# Altium project recive_coil.PrjPcb
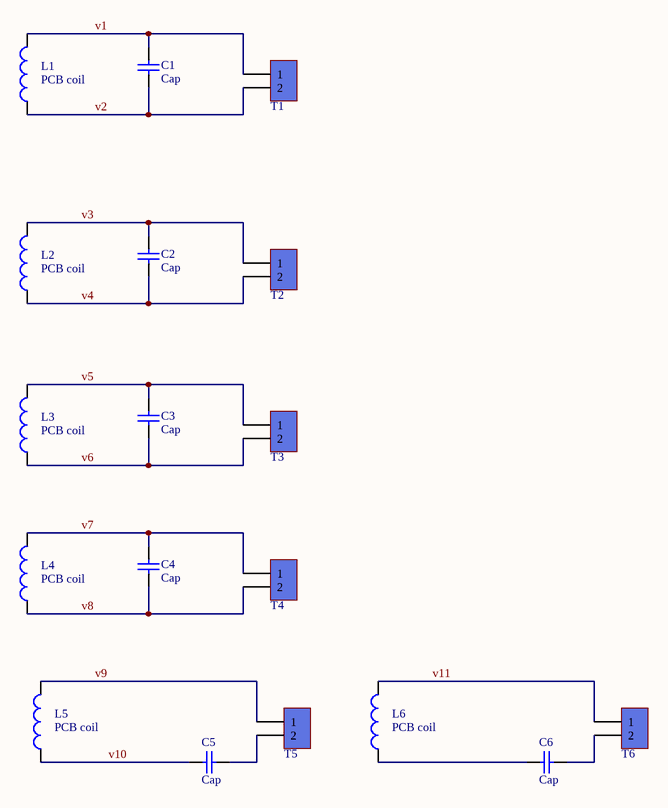
[diagram p0: Sheet1.SchDoc]
1 sheet, 18 parts. Net scope: global (net labels, ports and power ports of the same name join across sheets).
Board files: PCB1.PcbDoc, PCB2.PcbDoc

## Sheet Sheet1.SchDoc
size A4

### Parts
C1  Cap  [CAP_MKT]
C2  Cap  [CAP_MKT]
C3  Cap  [CAP_MKT]
C4  Cap  [CAP_MKT]
C5  Cap  [CAP_MKT]
C6  Cap  [CAP_MKT]
L1  PCB coil  [coil_30*30_1mm_2layer]  (net tie)
L2  PCB coil  [coil_30*30_2mm_1layer]  (net tie)
L3  PCB coil  [coil_30*30_2mm_2layer]  (net tie)
L4  PCB coil  [coil_30*30_3mm_2layer]  (net tie)
L5  PCB coil  [COIL_HEX_50*50_2layer]  (net tie)
L6  PCB coil  [COIL_HEX_50*50_2LAYER_2mm]  (net tie)
T1  Terminal  [Terminal 1*2_coil]  (value not drawn)
T2  Terminal  [Terminal 1*2_coil]  (value not drawn)
T3  Terminal  [Terminal 1*2_coil]  (value not drawn)
T4  Terminal  [Terminal 1*2_coil]  (value not drawn)
T5  Terminal  [Terminal 1*2_coil]  (value not drawn)
T6  Terminal  [Terminal 1*2_coil]  (value not drawn)

### Nets
v1: C1.2 L1.2 T1.1
v2: C1.1 L1.1 T1.2
v3: C2.2 L2.2 T2.1
v4: C2.1 L2.1 T2.2
v5: C3.2 L3.2 T3.1
v6: C3.1 L3.1 T3.2
v7: C4.2 L4.2 T4.1
v8: C4.1 L4.1 T4.2
v9: L5.2 T5.1
v10: C5.2 L5.1
v11: L6.2 T6.1
NetC5_1: C5.1 T5.2
NetC6_1: C6.1 T6.2
NetC6_2: C6.2 L6.1

### Library data of the parts
C1-C6 = Cap: Capacitor; Value: 100pF; Published: 8-Jun-2000; LatestRevisionDate: 17-Jul-2002; LatestRevisionNote: Re-released for DXP Platform.; PackageReference: RAD-0.3; Publisher: Altium Limited; PackageDescription: Radial Cap, Thru-Hole; 2 Leads; 0.3 in Pin Spacing
L1-L6 = Inductor: Code_IEC: 1005; Value: 10mH; Published: 8-Jun-2000; LatestRevisionDate: 29-May-2009; LatestRevisionNote: IPC-7351 Footprint Added.; PackageReference: 0402-A; Publisher: Altium Limited; PackageDescription: Chip Inductor; Code_JEITA: 0402
T1-T6 = Terminal 1*2: Terminal 2 Pin 250VAC 16A; Designer: Seyed Mohsen Ghasemain; E-mail: picpars@gmail.com; ComponentLinkURL: www.picpars.com